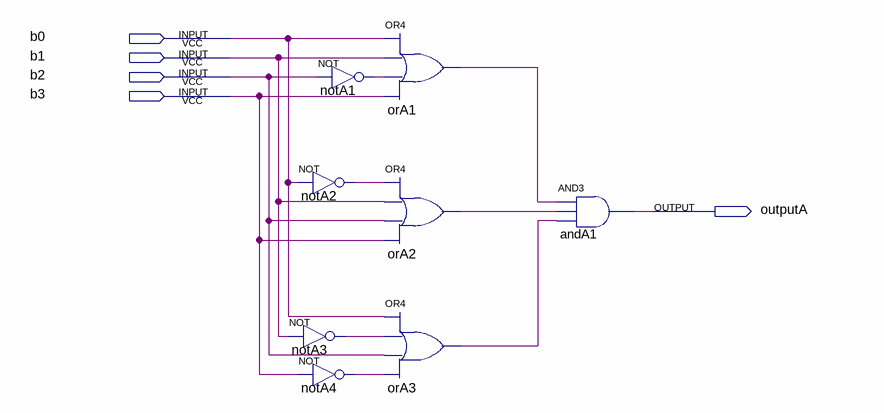
[diagram p0: schematic sheet]
// Quartus schematic a.bdf as structural Verilog: 8 symbols, 5 pins
module a (
  input  b0,
  input  b1,
  input  b2,
  input  b3,
  output outputA
);

  wire notA1_out, notA2_out, notA3_out, notA4_out, orA1_out, orA2_out, orA3_out;

  not notA1 (notA1_out, b2);
  not notA2 (notA2_out, b0);
  not notA3 (notA3_out, b1);
  not notA4 (notA4_out, b3);
  or orA1 (orA1_out, b0, b1, notA1_out, b3);
  or orA2 (orA2_out, notA2_out, b1, b2, b3);
  or orA3 (orA3_out, b0, notA3_out, b2, notA4_out);
  and andA1 (outputA, orA1_out, orA2_out, orA3_out);
endmodule
